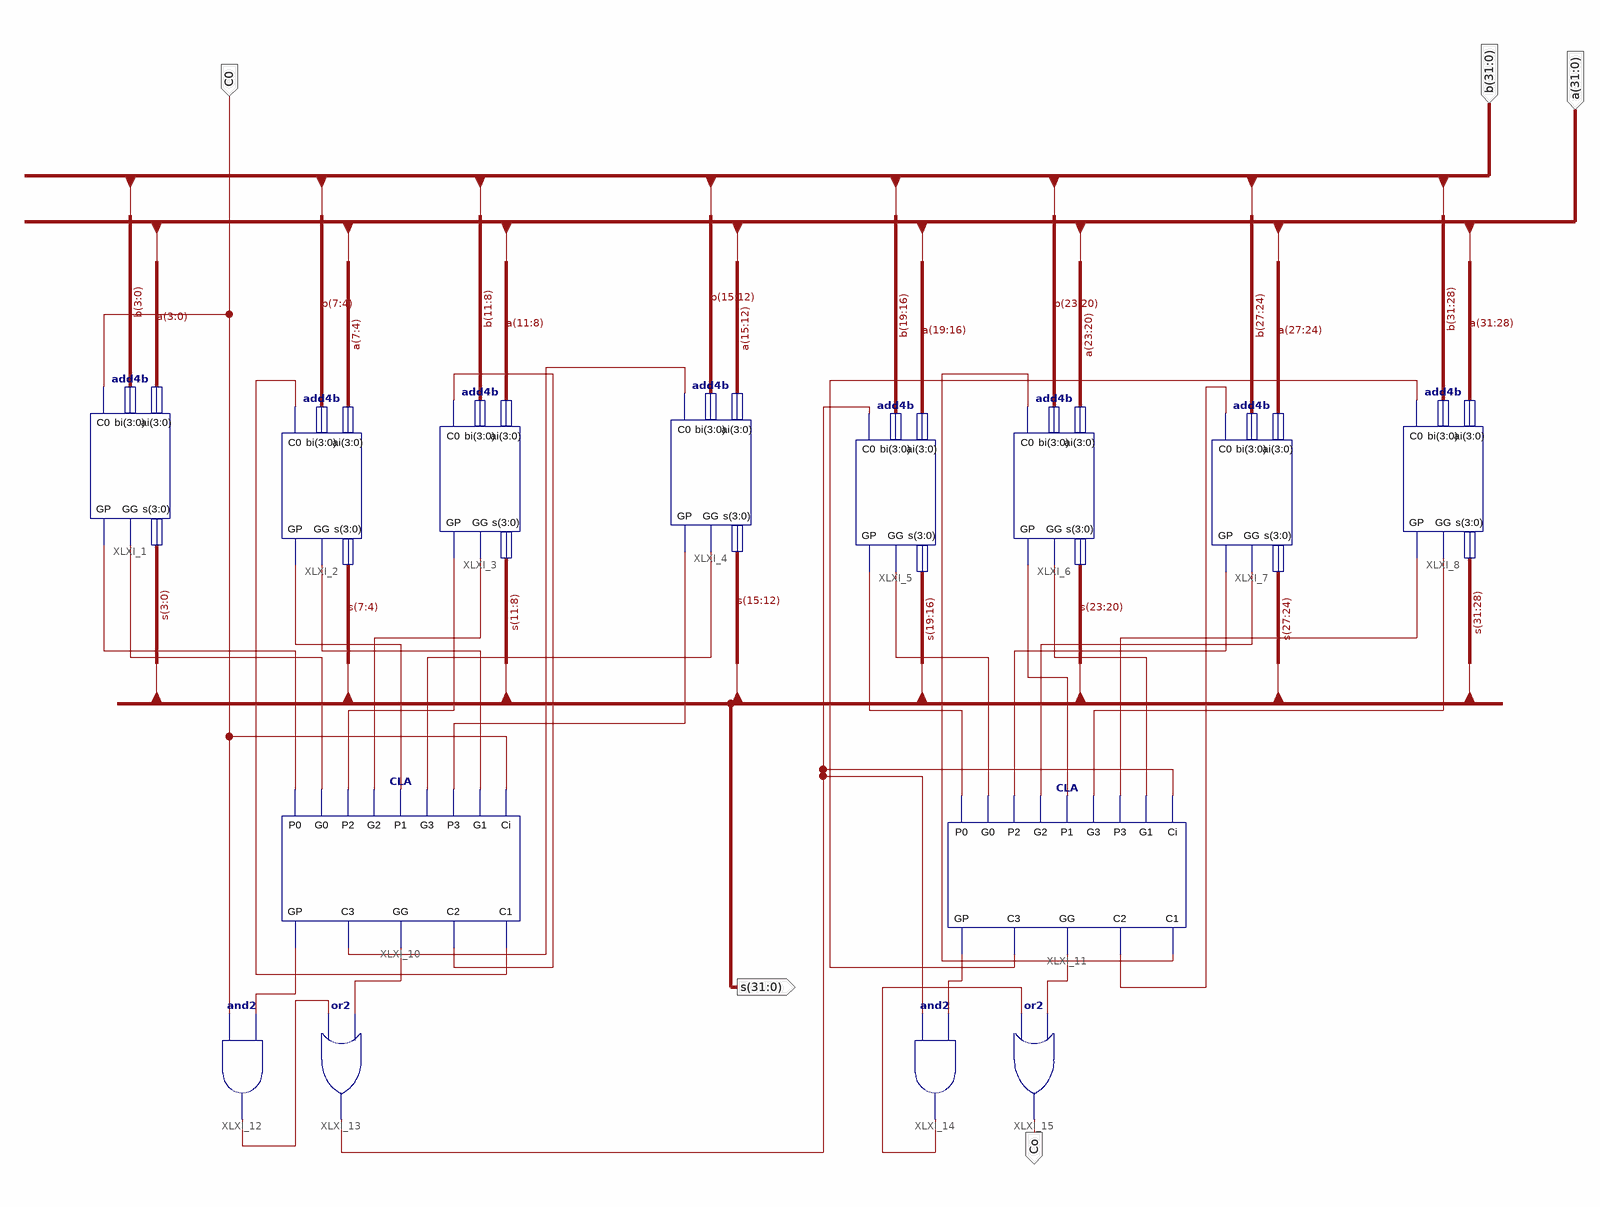
[diagram p0: schematic sheet 1]
// Xilinx ISE schematic ADC32.sch (kintex7) as structural Verilog: 14 symbols, 5 ports
module ADC32 (
  input  [31:0] b,
  input  [31:0] a,
  input  C0,
  output [31:0] s,
  output Co
);

  wire XLXN_34, XLXN_35, XLXN_36, XLXN_37, XLXN_38, XLXN_41, XLXN_42, XLXN_43, XLXN_44, XLXN_45, XLXN_46,
       XLXN_47, XLXN_48, XLXN_49, XLXN_50, XLXN_51, XLXN_52, XLXN_53, XLXN_54, XLXN_55, XLXN_56, XLXN_57,
       XLXN_58, XLXN_59, XLXN_60, XLXN_62, XLXN_63, XLXN_64, XLXN_65;

  add4b XLXI_1 (.ai(a[3:0]), .bi(b[3:0]), .C0(C0), .s(s[3:0]), .GG(XLXN_37), .GP(XLXN_38));
  add4b XLXI_2 (.ai(a[7:4]), .bi(b[7:4]), .C0(XLXN_47), .s(s[7:4]), .GG(XLXN_44), .GP(XLXN_41));
  add4b XLXI_3 (.ai(a[11:8]), .bi(b[11:8]), .C0(XLXN_48), .s(s[11:8]), .GG(XLXN_45), .GP(XLXN_42));
  add4b XLXI_4 (.ai(a[15:12]), .bi(b[15:12]), .C0(XLXN_49), .s(s[15:12]), .GG(XLXN_46), .GP(XLXN_43));
  add4b XLXI_5 (.ai(a[19:16]), .bi(b[19:16]), .C0(XLXN_58), .s(s[19:16]), .GG(XLXN_51), .GP(XLXN_50));
  add4b XLXI_6 (.ai(a[23:20]), .bi(b[23:20]), .C0(XLXN_63), .s(s[23:20]), .GG(XLXN_53), .GP(XLXN_52));
  add4b XLXI_7 (.ai(a[27:24]), .bi(b[27:24]), .C0(XLXN_64), .s(s[27:24]), .GG(XLXN_55), .GP(XLXN_54));
  add4b XLXI_8 (.ai(a[31:28]), .bi(b[31:28]), .C0(XLXN_65), .s(s[31:28]), .GG(XLXN_57), .GP(XLXN_56));
  CLA XLXI_10 (
    .Ci(C0), .G1(XLXN_44), .P3(XLXN_43), .G3(XLXN_46), .P1(XLXN_41), .G2(XLXN_45), .P2(XLXN_42),
    .G0(XLXN_37), .P0(XLXN_38), .C1(XLXN_47), .C2(XLXN_48), .GG(XLXN_36), .C3(XLXN_49), .GP(XLXN_34));
  CLA XLXI_11 (
    .Ci(XLXN_58), .G1(XLXN_53), .P3(XLXN_56), .G3(XLXN_57), .P1(XLXN_52), .G2(XLXN_55), .P2(XLXN_54),
    .G0(XLXN_51), .P0(XLXN_50), .C1(XLXN_63), .C2(XLXN_64), .GG(XLXN_62), .C3(XLXN_65), .GP(XLXN_59));
  and XLXI_12 (XLXN_35, C0, XLXN_34);
  or XLXI_13 (XLXN_58, XLXN_35, XLXN_36);
  and XLXI_14 (XLXN_60, XLXN_58, XLXN_59);
  or XLXI_15 (Co, XLXN_60, XLXN_62);
endmodule
